# Altium schematic sheet SHDN-BSPD-S10-V00-Buzzer.SchDoc: Buzzer
size A3; DrawnBy: John Dillon; DocumentNumber: 10; Revision: 01; SheetNumber: 10; SheetTotal: 12
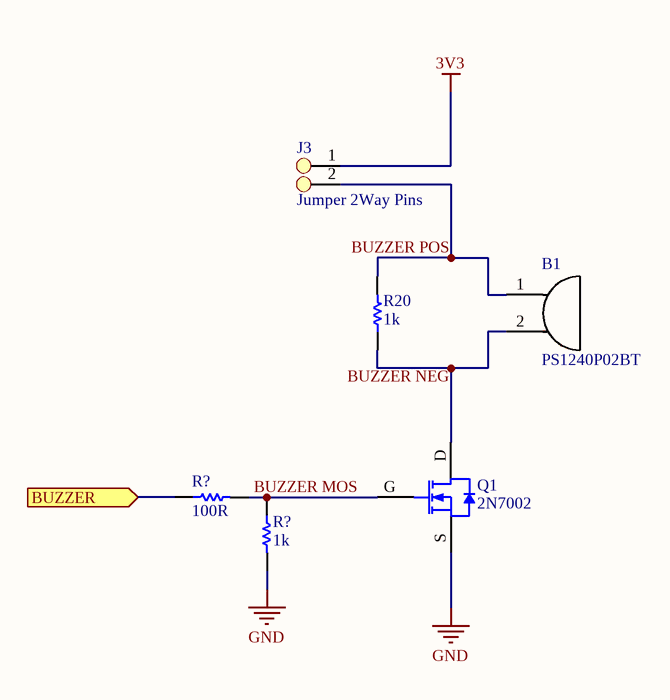
[diagram p0: SHDN-BSPD-S10-V00-Buzzer.SchDoc]

## Parts
(Parts that share a designator on the sheet are numbered #1, #2 ... from top to bottom, then left to right.)
B1  PS1240P02BT  [PS1240P02BT]
J3  Jumper 2Way Pins  [Jumper_2Way_Pin]
Q1  2N7002  [SOT23-3]
R20  1k  [Res_ThinFilm_0603]
R?#1  100R  [Res_ThinFilm_0603]
R?#2  1k  [Res_ThinFilm_0603]

## Ports
BUZZER (in)

## Nets
3V3: J3.1
GND: Q1.S R?#2.2
BUZZER: R?#1.1 ; port BUZZER
BUZZER MOS: Q1.G R?#1.2 R?#2.1
BUZZER NEG: B1.2 Q1.D R20.1
BUZZER POS: B1.1 J3.2 R20.2

## Notes on the sheet
- Revision History:
- Sheet Title:
- Rev
- Date
- Description
- Project:
- Size:
- Drawn By:
- A3
- Number:
- Revision:
- Sheet
- Version:
- of
- QUT Motorsport
- O-120, Gardens Point
- 2 George Street
- Brisbane, QLD 4000
- Australia
- Print Date:
- Print Time:
- File Name:

## Library data of the parts
B1 = PS1240P02BT: Buzzers Transducer, Externally Driven Piezo 3V 4kHz 60dB @ 3V, 10cm Through Hole PC Pins
J3 = Jumper 2Way Side Pins
R20 R?#2 = 1k 5% 0603: Resistor, SMD, 1k, 0.1W, 5%, 0603
R?#1 = 100R 5%, 0603: Resistor, SMD, 100R, 0.1W, 5%, 0603